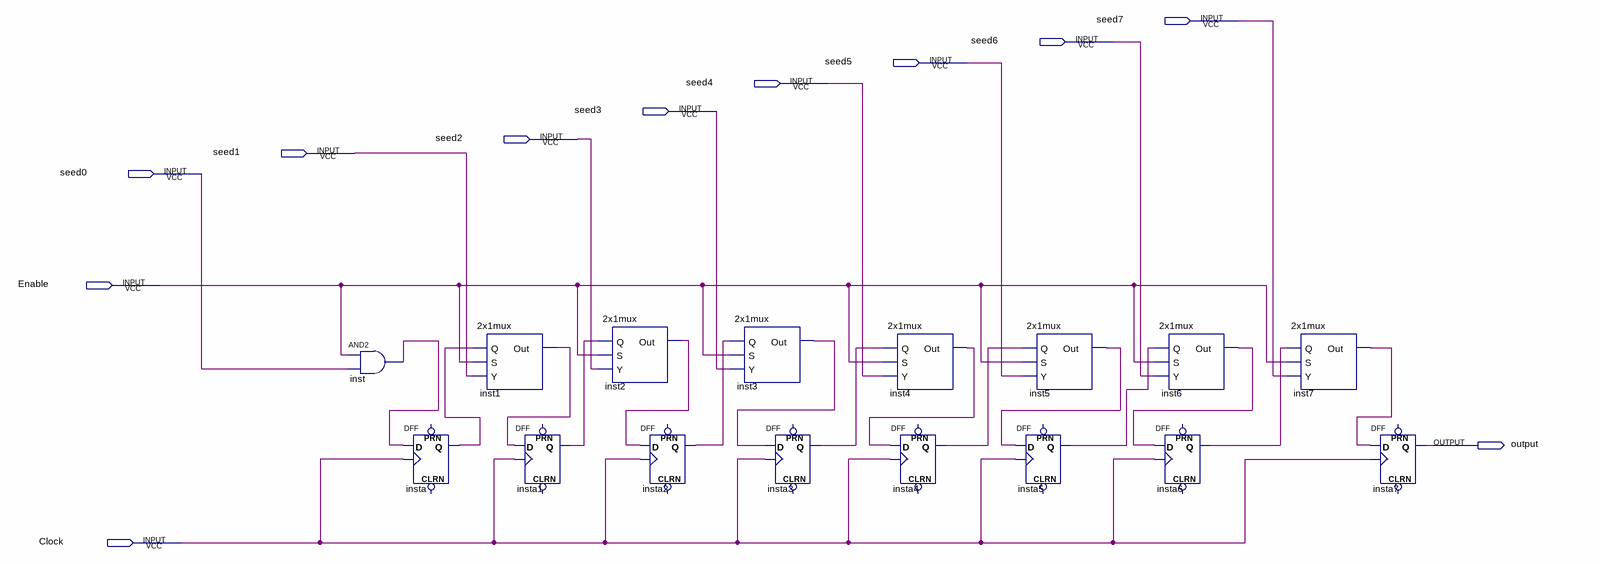
[diagram p0: schematic sheet]
// Quartus schematic 8-Bit-Shift.bdf as structural Verilog: 16 symbols, 11 pins
module \8-Bit-Shift  (
  input  seed7,
  input  seed6,
  input  seed5,
  input  seed4,
  input  seed3,
  input  seed2,
  input  seed1,
  input  seed0,
  input  Enable,
  input  Clock,
  output \output 
);

  wire inst1_out, inst2_out, inst3_out, inst4_out, inst5_out, inst6_out, inst7_out, inst_out, insta1_q,
       insta2_q, insta3_q, insta4_q, insta5_q, insta6_q, insta_q;

  and inst (inst_out, Enable, seed0);
  DFF insta (.CLK(Clock), .D(inst_out), .Q(insta_q));  // open: CLRN, PRN
  \2x1mux  inst1 (.Q(insta_q), .S(Enable), .Y(seed1), .Out(inst1_out));
  DFF insta1 (.CLK(Clock), .D(inst1_out), .Q(insta1_q));  // open: CLRN, PRN
  \2x1mux  inst2 (.Q(insta1_q), .S(Enable), .Y(seed2), .Out(inst2_out));
  DFF insta2 (.CLK(Clock), .D(inst2_out), .Q(insta2_q));  // open: CLRN, PRN
  \2x1mux  inst3 (.Q(insta2_q), .S(Enable), .Y(seed3), .Out(inst3_out));
  DFF insta3 (.CLK(Clock), .D(inst3_out), .Q(insta3_q));  // open: CLRN, PRN
  \2x1mux  inst4 (.Q(insta3_q), .S(Enable), .Y(seed4), .Out(inst4_out));
  DFF insta4 (.CLK(Clock), .D(inst4_out), .Q(insta4_q));  // open: CLRN, PRN
  \2x1mux  inst5 (.Q(insta4_q), .S(Enable), .Y(seed5), .Out(inst5_out));
  DFF insta5 (.CLK(Clock), .D(inst5_out), .Q(insta5_q));  // open: CLRN, PRN
  \2x1mux  inst6 (.Q(insta5_q), .S(Enable), .Y(seed6), .Out(inst6_out));
  DFF insta6 (.CLK(Clock), .D(inst6_out), .Q(insta6_q));  // open: CLRN, PRN
  \2x1mux  inst7 (.Q(insta6_q), .S(Enable), .Y(seed7), .Out(inst7_out));
  DFF insta7 (.CLK(Clock), .D(inst7_out), .Q(\output ));  // open: CLRN, PRN
endmodule
